# Altium schematic sheet 09-AD9513-2.SchDoc
size A; SheetNumber: 9; SheetTotal: 16
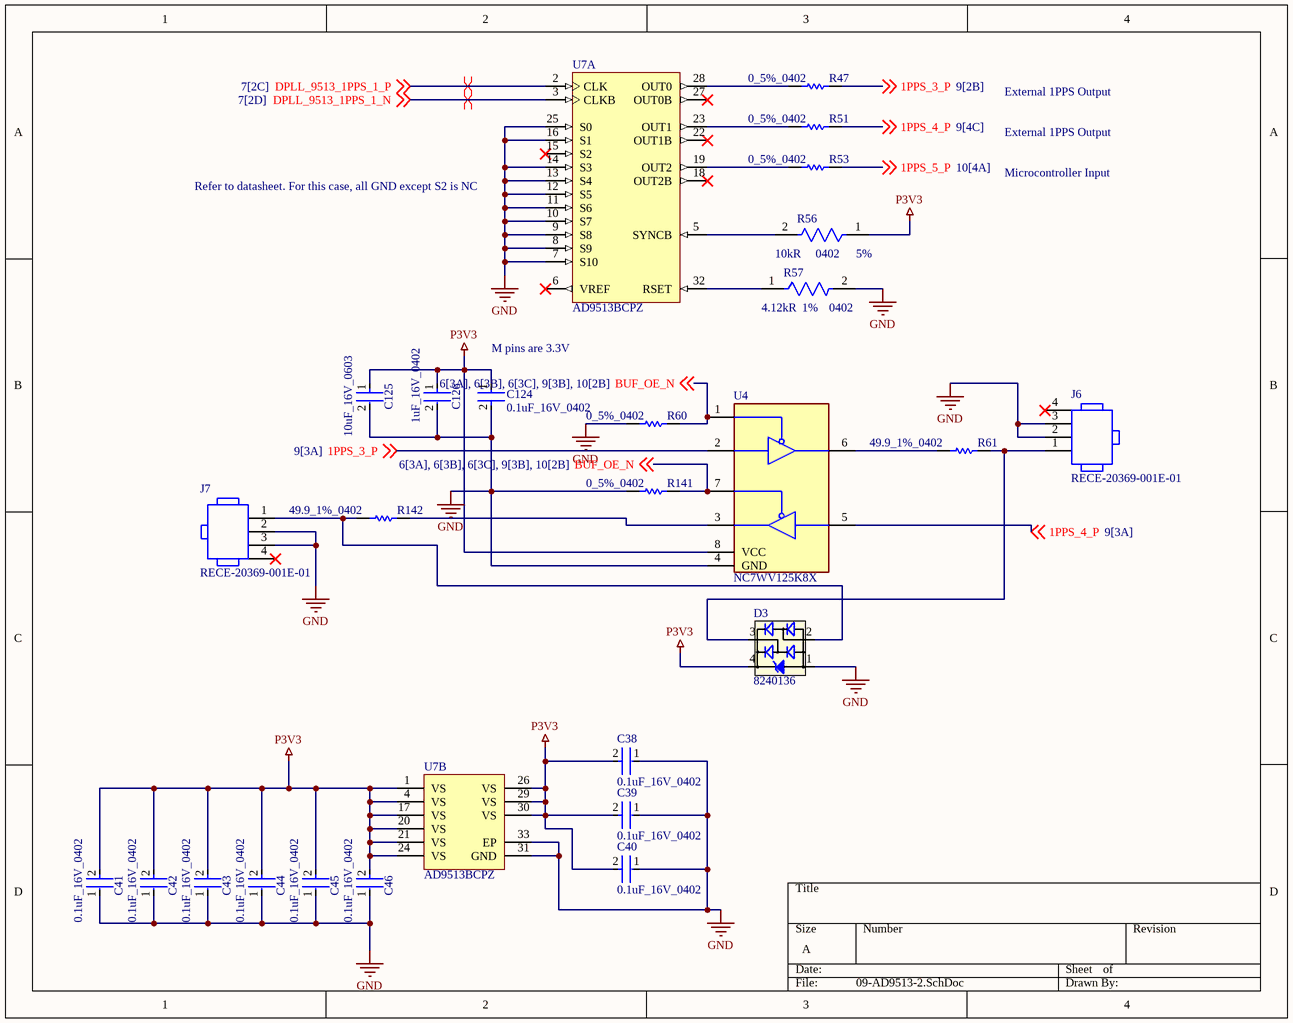
[diagram p0: 09-AD9513-2.SchDoc]

## Parts
C38  0.1uF_16V_0402  [FP-GRM15-MFG]
C39  0.1uF_16V_0402  [FP-GRM15-MFG]
C40  0.1uF_16V_0402  [FP-GRM15-MFG]
C41  0.1uF_16V_0402  [FP-GRM15-MFG]
C42  0.1uF_16V_0402  [FP-GRM15-MFG]
C43  0.1uF_16V_0402  [FP-GRM15-MFG]
C44  0.1uF_16V_0402  [FP-GRM15-MFG]
C45  0.1uF_16V_0402  [FP-GRM15-MFG]
C46  0.1uF_16V_0402  [FP-GRM15-MFG]
C124  Digikey Description: 0.1uF_16V_0402  [FP-GRM15-MFG]  (hidden comment: GRM155R71C104KA88D)
C125  10uF_16V_0603  [FP-C1608-MFG]
C126  1uF_16V_0402  [FP-0402-L_1_0_0_05-W_0_5-IPC_C]
D3  8240136  [SOT143-4L]
J6  RECE-20369-001E-01  [TG-RECE-20369-001E-4_V]
J7  RECE-20369-001E-01  [TG-RECE-20369-001E-4_V]
R47  0_5%_0402  [RESC1005X40X25LL10T10]
R51  0_5%_0402  [RESC1005X40X25LL10T10]
R53  0_5%_0402  [RESC1005X40X25LL10T10]
R56  Case/Package: 0402  Resistance: 10kR  Tolerance: 5%  [FP-CRCW0402-e3-IPC_B]  (hidden comment: CRCW040210K0JNED)
R57  Resistance: 4.12kR  Case/Package: 0402  Tolerance: 1%  [FP-CRCW0402-e3-IPC_A]  (hidden comment: CRCW04024K12FKED)
R60  0_5%_0402  [RESC1005X40X25LL10T10]
R61  49.9_1%_0402  [RESC1005X40X25NL05T05]
R141  0_5%_0402  [RESC1005X40X25LL10T10]
R142  49.9_1%_0402  [RESC1005X40X25NL05T05]
U4  NC7WV125K8X  [NC7WV125]
U7  AD9513BCPZ  [ADI-CP-32-2_N]  (parts A,B of 2)

## Nets
GND: C38.1 C39.1 C40.1 C41.1 C42.1 C43.1 C44.1 C45.1 C46.1 C124.2 C125.2 C126.2 D3.1(GND) J6.2 J6.3 J7.2 J7.3 R57.2 R60.1 R141.1 U4.4(GND) U7.7(S10) U7.8(S9) U7.9(S8) U7.10(S7) U7.11(S6) U7.12(S5) U7.13(S4) U7.14(S3) U7.16(S1) U7.25(S0) U7.31(GND) U7.33(EP)
P3V3: C38.2 C39.2 C40.2 C41.2 C42.2 C43.2 C44.2 C45.2 C46.2 C124.1 C125.1 C126.1 D3.4(VDD) R56.1 U4.8(VCC) U7.1(VS) U7.4(VS) U7.17(VS) U7.20(VS) U7.21(VS) U7.24(VS) U7.26(VS) U7.29(VS) U7.30(VS)
1PPS_3_P: R47.2 U4.2 ; off-sheet 1PPS_3_P
1PPS_4_P: R51.2 U4.5 ; off-sheet 1PPS_4_P
1PPS_5_P: R53.2 ; off-sheet 1PPS_5_P
BUF_OE_N: R60.2 R141.2 U4.1 U4.7 ; off-sheet BUF_OE_N
DPLL_9513_1PPS_1_N: U7.3(CLKB) ; off-sheet DPLL_9513_1PPS_1_N
DPLL_9513_1PPS_1_P: U7.2(CLK) ; off-sheet DPLL_9513_1PPS_1_P
NetD3_2: D3.2(I/O1) J7.1 R142.2
NetD3_3: D3.3(I/O2) J6.1 R61.1
NetR47_1: R47.1 U7.28(OUT0)
NetR51_1: R51.1 U7.23(OUT1)
NetR53_1: R53.1 U7.19(OUT2)
NetR56_2: R56.2 U7.5(SYNCB)
NetR57_1: R57.1 U7.32(RSET)
NetR61_2: R61.2 U4.6
NetR142_1: R142.1 U4.3

Not connected (* = marked no-connect by the designer): J6 4*; J7 4*; U7 6(VREF)* 15(S2)* 18(OUT2B)* 22(OUT1B)* 27(OUT0B)*

## Layout directives
differential pair; differential pair class 100ohm: DPLL_9513_1PPS_1_N, DPLL_9513_1PPS_1_P

## Notes on the sheet
- External 1PPS Output
- (near U7) Refer to datasheet. For this case, all GND except S2 is NC
- Microcontroller Input
- M pins are 3.3V

## Library data of the parts
C38-C46 = CMP-2100-03641-2: CAP CER 0.1UF 16V X7R 0402; Manufacturer Part Number: GRM155R71C104KA88D; Manufacturer: Murata; Standoff Height: 0mm; Tolerance: 10%; Voltage Rating: 16Vdc; Material: Ceramic; Capacitance: 0.10μF; Value: 0.10μF; RoHS: TRUE; Temperature Characteristic: X7R; Octopart: https://octopart.com/grm155r71c104ka88d-murata-196880; Digikey Description: CAP CER 0.1UF 16V X7R 0402; Device Class L3: Ceramic Capacitors; Height: 0.55mm; ComponentLink2Description: Datasheet; Temperature Range Low: -55°C; Ipc Land Pattern Name: CAPC10050X219; ComponentLink2URL: https://search.murata.co.jp/Ceramy/image/img/A01X/G101/ENG/GRM155R71H471KA01-01A.pdf; Device Class L1: Passive Components; Lead Free: yes; Category: Cap; Package: GRM15; Temperature: -55°C to +125°C; Device Class L2: Capacitors; Temperature Range High: +125°C; Mouser Description: 0402 0.1 uF 16V ±10 % Tolerance X7R SMT Multilayer Ceramic Capacitor
C124 = CMP-2100-03641-2: CAP CER 0.1UF 16V X7R 0402; Manufacturer: Murata; Standoff Height: 0mm; Tolerance: 10%; Voltage Rating: 16Vdc; Material: Ceramic; Capacitance: 0.10μF; Value: 0.10μF; RoHS: TRUE; Manufacturer Part Number: GRM155R71C104KA88D; Temperature Characteristic: X7R; Octopart: https://octopart.com/grm155r71c104ka88d-murata-196880; Device Class L3: Ceramic Capacitors; Height: 0.55mm; ComponentLink2Description: Datasheet; Temperature Range Low: -55°C; Ipc Land Pattern Name: CAPC10050X219; ComponentLink2URL: https://search.murata.co.jp/Ceramy/image/img/A01X/G101/ENG/GRM155R71H471KA01-01A.pdf; Device Class L1: Passive Components; Lead Free: yes; Category: Cap; Package: GRM15; Temperature: -55°C to +125°C; Device Class L2: Capacitors; Temperature Range High: +125°C; Mouser Description: 0402 0.1 uF 16V ±10 % Tolerance X7R SMT Multilayer Ceramic Capacitor
C125 = CMP-08246-000019-1: CAP CER 10UF 16V X5R 0603; Manufacturer: TDK Corporation; Manufacturer Part Number: C1608X5R1C106M080AB; Temperature Coefficient: 15%; Tolerance: 20%; Material: Ceramic; Octopart: https://octopart.com/c1608x5r1c106m080ab-tdk-26013480; ComponentLink2Description: Datasheet; Value: 10uF; Temperature Range Low: -55°C; Digikey Description: CAP CER 10UF 16V X5R 0603; Package: C1608; Lead Free: Yes; Mouser Description: Multilayer Ceramic Capacitors MLCC - SMD/SMT 0603 10uF 16volts X5R +/-20% GP; Device Class L2: Capacitors; Voltage Rating: 16V; RoHS: TRUE; Automotive: No; Height: 0.9mm; Ipc Land Pattern Name: CAPC16080X80; ComponentLink2URL: https://upverter.com/datasheet/6fbac97fd59b4a24a005814037d2a36a27db40e9.pdf; Temperature Range High: +85°C; Capacitance: 10uF; Temperature: -55°C to +85°C; Category: Cap; Device Class L1: Passive Components; Device Class L3: Ceramic Capacitors; Temperature Characteristic: X5R
C126 = CMP-14477-003537-2: None; Tolerance: 20%; Voltage Rating (DC): 16V; Capacitance: 1uF; Dielectric: X5R; Height: 0.5mm; Package Quantity: 10000; Series: M; Max Operating Temperature: 85°C; Width: 0.02inch; Mount: Surface Mount; Thickness: 0.022inch; Length: 1mm; Min Operating Temperature: -55°C; Depth: 0.5mm; RoHS Compliant: Yes; Construction: Flat; Case/Package: 0402; Radiation Hardening: No; Packaging: Tape and Reel; Voltage: 16V; Voltage Rating: 16V; Halogen Free: Halogen Free
D3 = CMP-1486-00002-1: TVS Diode WE-TVS-HS, VRWM=3.3V; Manufacturer: Wuerth Elektronik; Reverse Stand Off Voltage: 3.3V; PartNumber: 8240136; ComponentLink1Description: Manufacturer URL; PackageReference: SOT143-4L; ComponentLink1URL: http://www.we-online.com; ComponentLink2Description: Datasheet; ComponentLink2URL: http://katalog.we-online.de/kataloge/eisos/media/pdf/8240136.pdf
J6 J7 = CMP-0275-00001-2: RF Connector, Onboard Receptacle, IPEX MHFIII; Manufacturer: Taoglas; Packing: Tape and Reel; Mounting Technology: Surface Mount; PackageReference: RECE-20369-001E-01-4; ComponentLink1URL: http://www.taoglas.com/; Housing Color: Gold; DatasheetVersion: Rev. C; ComponentLink2URL: http://www.taoglas.com/images/product_images/original_images/RECE.20369.001E.01.pdf; ComponentLink3Description: Package Specification; PackageVersion: Rev. C; ComponentLink1Description: Manufacturer URL; ComponentLink2Description: Datasheet; PackageDescription: 4-Pin, Hand Drawn, Body 1.7x1.7mm; ComponentLink3URL: http://www.taoglas.com/images/product_images/original_images/RECE.20369.001E.01.pdf; PartNumber: RECE-20369-001E-01
R47 R51 R53 R60 R141 = CMP-2002-04569-1: Manufacturer: KOA Speer; Part Number: RK73Z1ETTP
R56 = CMP-2002-08136-3: RES Thick Film, 10kΩ, 5%, 0.063W, 200ppm/°C, 0402; Voltage Rating: 50V; Power Rating: 63mW; Military Standard: Not; Packaging: Tape and Reel; Case Code (Imperial): 0402; Min Operating Temperature: -55°C; Case Code (Metric): 1005; Temperature Coefficient: 200ppm/°C; Termination: SMD/SMT; Composition: Thick Film; Depth: 0.5mm; Number of Terminations: 2; Contact Plating: Tin; Height: 0.016inch; Width: 0.5mm; Max Operating Temperature: 155°C; Features: Automotive AEC-Q200; Length: 1mm; Radiation Hardening: No; Max Power Dissipation: 63mW; Mount: Surface Mount; Package Quantity: 1; Weight: 2.3E-05oz
R57 = CMP-1011-00579-3: RES Thick Film, 4.12kΩ, 1%, 0.063W, 100ppm/°C, 0402; Power Rating: 63mW; Voltage Rating: 50V; Temperature Coefficient: 100ppm/°C; Max Operating Temperature: 155°C; Number of Terminations: 2; Number of Pins: 2; Radiation Hardening: No; Features: Automotive AEC-Q200; Height: 0.35mm; Length: 1mm; Lead Free: Lead Free; Military Standard: Not; Composition: Thick Film; Weight: 2.3E-05oz; Case Code (Metric): 1005; Case Code (Imperial): 0402; Max Power Dissipation: 63mW; Contact Plating: Tin; Min Operating Temperature: -55°C; Width: 0.02inch; Packaging: Tape and Reel; Depth: 0.5mm; Termination: SMD/SMT; Voltage Rating (DC): 50V; Package Quantity: 10
R61 R142 = CMP-2002-00969-1: Manufacturer: Panasonic; Part Number: ERJ-2RKF49R9X
U4 = NC7WV125K8X: Integrated Circuit; Manufacturer_Name: ON Semiconductor; Datasheet Link: https://www.mouser.com/datasheet/2/308/NC7WV125-1301459.pdf; Height: 0.9mm; Manufacturer_Part_Number: NC7WV125K8X; Mouser Part Number: 512-NC7WV125K8X; Mouser Price/Stock: https://www.mouser.com/Search/Refine.aspx?Keyword=512-NC7WV125K8X; Arrow Part Number: NC7WV125K8X; Arrow Price/Stock: https://www.arrow.com/en/products/nc7wv125k8x/on-semiconductor
U7 = CMP-0288-00055-2: 3 Outputs, 800 MHz Clock Distribution IC with Dividers and Delay Adjust, 3.3 V Supply, Industrial, 32-pin QFN (CP-32-2), Tray; Manufacturer: Analog Devices; # of Outputs: 3; Max f-out: 800 MHz; On-Chip VCO or DCO: No; I/O Interface: Pin Select; Supply Voltage (V): 3.3; Output Logic: CMOS, LVDS; # of Inputs: 1; Packing: Tray; DatasheetVersion: Rev. 0; ComponentLink5Description: Reference Circuit; PartNumber: AD9513BCPZ; ComponentLink1Description: Manufacturer URL; ComponentLink2Description: Datasheet; ComponentLink1URL: http://www.analog.com/en/index.html; ComponentLink4URL: http://www.analog.com/en/clock-and-timing/clock-generation-and-distribution/ad9513/products/product.html; Code_JEDEC: MO-220-VHHD-2; ComponentLink3URL: http://www.analog.com/static/imported-files/packages/414143737956480539664569CP_32_2.pdf; PackageDescription: 32-Pin Lead Frame Chip Scale Package, Body 5 x 5 mm, Pitch 0.5 mm; PackageReference: CP-32-2; ComponentLink3Description: Package Specification; ComponentLink4Description: Product URL; Mounting Technology: Surface Mount; PackageVersion: 01/2005; ComponentLink2URL: http://www.analog.com/static/imported-files/data_sheets/AD9513.pdf; ComponentLink5URL: http://www.analog.com/en/clock-and-timing/clock-generation-and-distribution/ad9513/products/product.html#product-recommendations